# EAGLE design mixer (EAGLE 5.06)
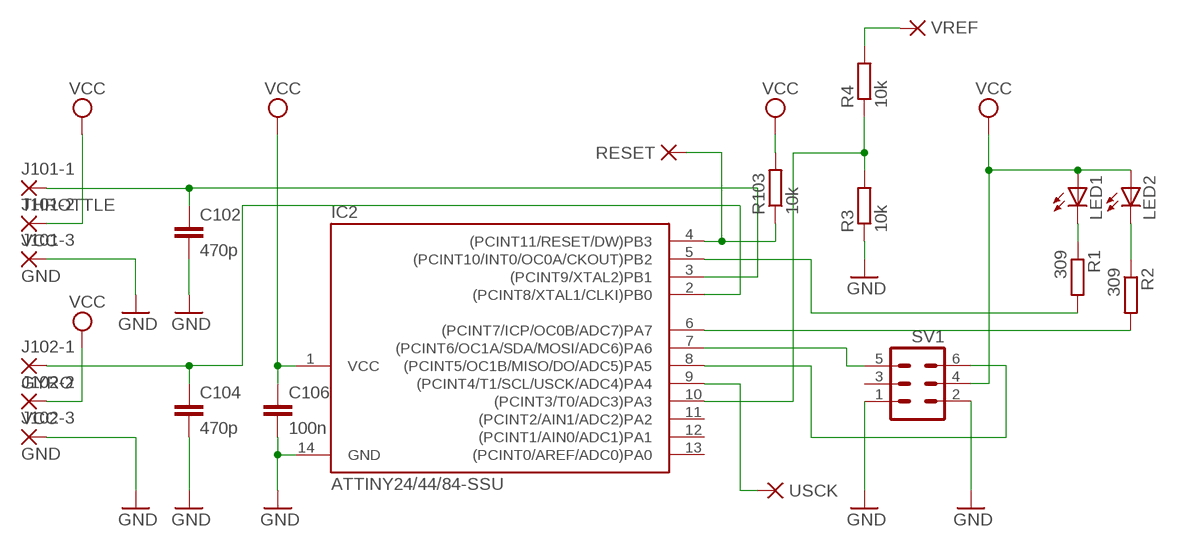
[diagram p0: schematic, sheet 1]

## Parts
C102  470p  C-EUC0805  [C0805]
C104  470p  C-EUC0805  [C0805]
C106  100n  C-EUC0805  [C0805]
IC2  ATTINY24/44/84-SSU  [SOIC14]
J101-1  THROTTLE  1,6/0,8  [1,6/0,8]
J101-2  VCC  1,6/0,8  [1,6/0,8]
J101-3  GND  1,6/0,8  [1,6/0,8]
J102-1  GYRO  1,6/0,8  [1,6/0,8]
J102-2  VCC  1,6/0,8  [1,6/0,8]
J102-3  GND  1,6/0,8  [1,6/0,8]
LED1  LEDCHIP-LED0805  [CHIP-LED0805]
LED2  LEDCHIP-LED0805  [CHIP-LED0805]
R1  309  R-EU_R0805  [R0805]
R2  309  R-EU_R0805  [R0805]
R3  10k  R-EU_R0805  [R0805]
R4  10k  R-EU_R0805  [R0805]
R103  10k  R-EU_R0805  [R0805]
RESET  PAD-SMD10S  [SMD10S]
SV1  MA03-2  [MA03-2]
USCK  PAD-SMD10S  [SMD10S]
VREF  PAD-0240-S  [0240-S]

## Nets
GND: C102.2 C104.2 C106.2 IC2.14(GND) J101-3.1(P) J102-3.1(P) R3.1 SV1.1 SV1.2
N$1: IC2.4((PCINT11/RESET/DW)PB3) R103.1 RESET.PAD(P)
N$2: IC2.10((PCINT3/T0/ADC3)PA3) R3.2 R4.1
N$3: C104.1 IC2.2((PCINT8/XTAL1/CLKI)PB0) J102-1.1(P)
N$4: LED1.C R1.1
N$5: LED2.C R2.1
N$6: IC2.6((PCINT7/ICP/OC0B/ADC7)PA7) R2.2
N$7: IC2.5((PCINT10/INT0/OC0A/CKOUT)PB2) R1.2
N$8: R4.2 VREF.P$1(P)
N$10: IC2.9((PCINT4/T1/SCL/USCK/ADC4)PA4) USCK.PAD(P)
OUT1: IC2.7((PCINT6/OC1A/SDA/MOSI/ADC6)PA6) SV1.5
OUT2: IC2.8((PCINT5/OC1B/MISO/DO/ADC5)PA5) SV1.6
THROTTLE: C102.1 IC2.3((PCINT9/XTAL2)PB1) J101-1.1(P)
VCC: C106.1 IC2.1(VCC) J101-2.1(P) J102-2.1(P) LED1.A LED2.A R103.2 SV1.4
Unconnected: IC2.11((PCINT2/AIN1/ADC2)PA2) IC2.12((PCINT1/AIN0/ADC1)PA1) IC2.13((PCINT0/AREF/ADC0)PA0) SV1.3

## Library data of the parts
C102 C104 C106 = rcl:C-EU: CAPACITOR, European symbol
IC2 = attiny24_44_84:ATTINY24/44/84
J101-1-J101-3 J102-1-J102-3 = wirepad:1,6/0,8: THROUGH-HOLE PAD
LED1 LED2 = led:LED: LED OSRAM: - CHIPLED LG R971, LG N971, LY N971, LG Q971, LY Q971, LO R971, LY R971 LH N974, LH R974 LS Q976, LO Q976, LY Q976 LO Q996 - Hyper CHIPLED LW Q18S LB Q993, LB Q99A, LB R99A - SideLED LS A670, LO A670, LY A670, LG A670, LP A670 LB A673, LV A673, LT A673, LW A673 LH A674 LY A675 LS A676, LA A676, LO A676, LY A676, LW A676 LS A679, LY A679, LG A679 - Hyper Micro SIDELED® LS Y876, LA Y876, LO Y876, LY Y876 LT Y87S - SmartLED LW L88C, LW L88S LB L89C, LB L89S, LG L890 LS L89K, LO L89K, LY L89K LS L896, LA L896, LO L896, LY L896 - TOPLED LS T670, LO T670, LY T670, LG T670, LP T670 LSG T670, LSP T670, LSY T670, LOP T670, LYG T670 LG T671, LOG T671, LSG T671 LB T673, LV T673, LT T673, LW T673 LH T674 LS T676, LA T676, LO T676, LY T676, LB T676, LH T676, LSB T676, LW T676 LB T67C, LV T67C, LT T67C, LS T67K, LO T67K, LY T67K, LW E67C LS E67B, LA E67B, LO E67B, LY E67B, LB E67C, LV E67C, LT E67C LW T67C LS T679, LY T679, LG T679 LS T770, LO T770, LY T770, LG T770, LP T770 LB T773, LV T773, LT T773, LW T773 LH T774 LS E675, LA E675, LY E675, LS T675 LS T776, LA T776, LO T776, LY T776, LB T776 LHGB T686 LT T68C, LB T68C - Hyper Mini TOPLED® LB M676 - Mini TOPLED Santana® LG M470 LS M47K, LO M47K, LY M47K Source: http://www.osram.convergy.de LUXEON: - LUMILED® LXK2-PW12-R00, LXK2-PW12-S00, LXK2-PW14-U00, LXK2-PW14-V00 LXK2-PM12-R00, LXK2-PM12-S00, LXK2-PM14-U00 LXK2-PE12-Q00, LXK2-PE12-R00, LXK2-PE12-S00, LXK2-PE14-T00, LXK2-PE14-U00 LXK2-PB12-K00, LXK2-PB12-L00, LXK2-PB12-M00, LXK2-PB14-N00, LXK2-PB14-P00, LXK2-PB14-Q00 LXK2-PR12-L00, LXK2-PR12-M00, LXK2-PR14-Q00, LXK2-PR14-R00 LXK2-PD12-Q00, LXK2-PD12-R00, LXK2-PD12-S00 LXK2-PH12-R00, LXK2-PH12-S00 LXK2-PL12-P00, LXK2-PL12-Q00, LXK2-PL12-R00 Source: www.luxeon.com KINGBRIGHT: KA-3528ASYC Source: www.kingbright.com
R1-R4 R103 = rcl:R-EU_: RESISTOR, European symbol
RESET USCK VREF = dpads:PAD: WIRE PAD Standard US Drill Sizes and SMD pads
SV1 = con-lstb:MA03-2: PIN HEADER

## Board
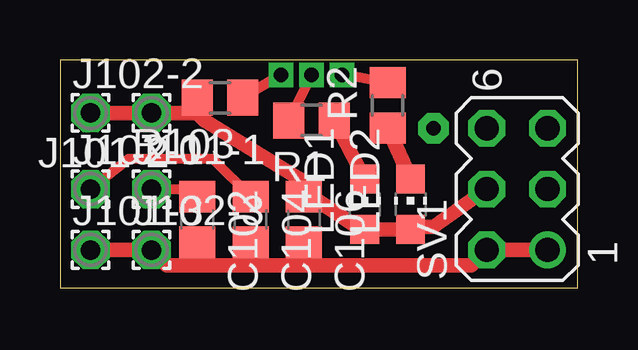
[diagram p1: board, top side]
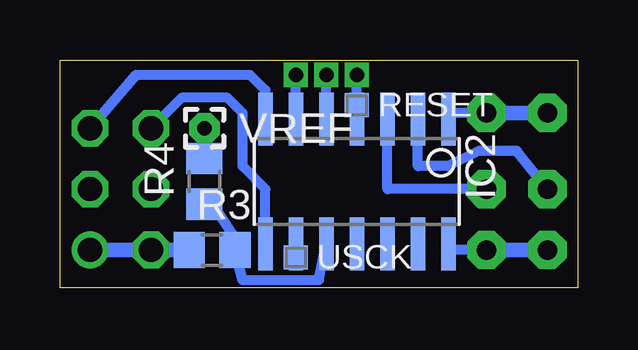
[diagram p2: board, bottom side, seen from below]

Size 21.58 x 9.52 mm. Coordinates in mm from the lower left corner, seen from the top.
Outline: 0,0 21.58,0 21.58,9.52 0,9.52 0,0
Copper layers (1*16): Top 0.035mm / dielectric 1.5mm / Bottom 0.035mm
Design rules "default *": minimum track width 10mil, minimum drill 0.6mm, track to track 8mil, track to pad 8mil, pad to pad 8mil, via to via 8mil, smd to smd 8mil, copper to edge 5mil, drill to drill 8mil, minimum pad ring 10mil, minimum via ring 8mil, stop-mask expansion 4mil, vias tented up to drill 0mil, thermal gap 10mil

### Footprints (pad centres in the part's own frame; a part is rotated, then mirrored left to right if it is on the bottom)
C0805 = smd 1.3 x 1.5: 1 -0.95,0; 2 0.95,0
SOIC14 = smd 0.61 x 2.21: 1 -3.81,-2.603; 2 -2.54,-2.603; 3 -1.27,-2.603; 4 0,-2.603; 5 1.27,-2.603; 6 2.54,-2.603; 7 3.81,-2.603; 8 3.81,2.603; 9 2.54,2.603; 10 1.27,2.603; 11 0,2.603; 12 -1.27,2.603; 13 -2.54,2.603; 14 -3.81,2.603
1,6/0,8 = drill 0.813 pad 1.6 octagon: 1 0,0
CHIP-LED0805 = smd 1.2 x 1.2: A 0,-1.05; C 0,1.05
R0805 = smd 1.3 x 1.5: 1 -0.95,0; 2 0.95,0
SMD10S = smd 1 x 1: PAD 0,0
MA03-2 = drill 1.016 round: 1 -2.54,-1.27 | drill 1.016 octagon: 2 -2.54,1.27; 3 0,-1.27; 4 0,1.27; 5 2.54,-1.27; 6 2.54,1.27
0240-S = drill 0.61 pad 1.27 octagon: P$1 0,0

### Placement (x,y rotation side)
C102  5.71,2.86 270 top
C104  7.94,2.86 270 top
C106  10.16,2.86 270 top
IC2  9.21,4.44 180 bottom
J101-1  3.81,4.13 0 top
J101-2  3.81,7.3 180 top
J101-3  1.27,1.59 0 top
J102-1  1.27,4.13 0 top
J102-2  1.27,7.3 0 top
J102-3  3.81,1.59 0 top
LED1  12.7,3.49 0 top
LED2  14.61,3.49 0 top
R1  10.48,6.98 180 top
R2  13.65,7.62 90 top
R3  15.24,1.59 0 bottom
R4  15.56,4.44 90 bottom
R103  6.67,7.94 180 top
RESET  9.21,7.62 0 bottom
SV1  19.05,4.13 90 top
USCK  11.75,1.27 0 bottom
VREF  15.56,6.67 0 bottom

### Tracks (layer width: path | path; a pad name or v marks a point on that pad's centre or on a via)
GND
  Top 0.61: J101-3.1 J102-3.1 4.45,0.95 5.72,0.95 | SV1.1 SV1.2 17.15,0.95 10.16,0.95 | 5.72,0.95 C102.2 | 5.72,0.95 7.94,0.95 | 7.94,0.95 C104.2 | 7.94,0.95 10.16,0.95 | 10.16,0.95 C106.2
  Bottom 0.406: J102-3.1 5.14,1.59 | J101-3.1 5.4,1.59 IC2.14
  Bottom 0.61: J101-3.1 J102-3.1 | SV1.1 SV1.2 R3.1
N$1  (via drill 0.6)
  Top 0.406: v9.21,8.89 R103.1
  Bottom 0.406: RESET.PAD IC2.4 RESET.PAD | RESET.PAD v9.21,8.89
N$2
  Bottom 0.406: R4.1 15.24,3.49 13.97,1.59 R3.2 13.97,0.32 10.79,0.32 IC2.10
N$3
  Top 0.406: J102-1.1 2.86,5.4 6.35,5.4 C104.1
  Bottom 0.406: IC2.2 6.67,5.08 5.4,5.08 4.13,5.71 2.54,5.71 J102-1.1
N$4
  Top 0.61: LED1.C R1.1
N$5
  Top 0.61: LED2.C R2.1
N$6  (via drill 0.6)
  Top 0.406: R2.2 12.07,8.89 v11.75,8.89
  Bottom 0.406: IC2.6 v11.75,8.89
N$7  (via drill 0.6)
  Top 0.406: R1.2 v10.48,8.89
  Bottom 0.406: IC2.5 v10.48,8.89
N$8
  Bottom 0.406: R4.2 VREF.P$1
N$10
  Bottom 0.406: USCK.PAD IC2.9
OUT1
  Bottom 0.406: SV1.5 18.41,8.89 13.65,8.89 13.02,8.25 IC2.7
OUT2
  Bottom 0.406: SV1.6 16.51,7.94 14.61,7.94 13.97,7.3 13.97,5.08 13.02,4.13 IC2.8
THROTTLE
  Top 0.406: J101-1.1 5.72,4.13 C102.1
  Bottom 0.406: J101-1.1 7.94,4.13 IC2.3
VCC
  Top 0.406: 5.72,7.3 R103.2
  Top 0.61: J102-2.1 J101-2.1 5.72,7.3 6.03,6.99 10.16,4.44 C106.1 10.47,3.81 12.38,2.54 13.33,2.44 LED1.A LED2.A 14.61,2.54 15.56,2.54 SV1.4
  Bottom 0.406: J101-2.1 5.4,7.3 IC2.1
  Bottom 0.61: J102-2.1 J101-2.1